# Altium schematic sheet Accelerometer.SchDoc
size A
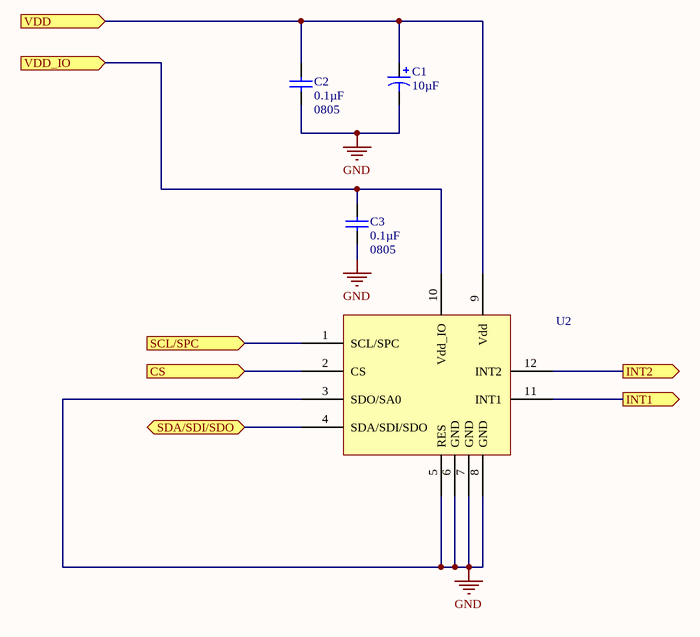
[diagram p0: Accelerometer.SchDoc]

## Parts
C1  Capacitance: 10µF  [Aluminum Cap 875105240001]  (hidden comment: 875105240001)
C2  Capacitance: 0.1µF  Package / Case: 0805  [CAP0805]  (hidden comment: C0805C104K5RACTU)
C3  Capacitance: 0.1µF  Package / Case: 0805  [CAP0805]  (hidden comment: C0805C104K5RACTU)
U2  LIS2HH12TR  [LIS2HH12TR]  (value not drawn)

## Ports
CS (in), INT1 (out), INT2 (out), SCL/SPC (in), SDA/SDI/SDO (bidir), VDD (in), VDD_IO (in)

## Nets
GND: C1.2 C2.1 C3.1 U2.3(SDO/SA0) U2.5(RES) U2.6(GND) U2.7(GND) U2.8(GND)
CS: U2.2(CS) ; port CS
INT1: U2.11(INT1) ; port INT1
INT2: U2.12(INT2) ; port INT2
SCL/SPC: U2.1(SCL/SPC) ; port SCL/SPC
SDA/SDI/SDO: U2.4(SDA/SDI/SDO) ; port SDA/SDI/SDO
VDD: C1.1 C2.2 U2.9(Vdd) ; port VDD
VDD_IO: C3.2 U2.10(Vdd_IO) ; port VDD_IO

## Library data of the parts
C1 = 875105240001: CAP ALUM POLY 10UF 20% 10V SMD; Type: Polymer; ESR (Equivalent Series Resistance): 45 mOhm; Lifetime @ Temp.: 2000 Hrs @ 105°C; Ripple Current - Low Frequency: 60mA @ 120Hz; Ripple Current - High Frequency: 1.2A @ 100kHz; Surface Mount Land Size: 0.169" L x 0.169" W (4.30mm x 4.30mm); Tolerance: ±20%; Voltage - Rated: 10V; Operating Temperature: -55°C ~ 105°C; Applications: General Purpose; Size / Dimension: 0.157" Dia (4.00mm); Height - Seated (Max): 0.217" (5.50mm); Package / Case: Radial, Can - SMD; Supplier 1: Digi-Key; Supplier Part Number 1: 732-6401-1-ND
C2 C3 = C0805C104K5RACTU: CAP CER 0.1UF 50V X7R 0805; Tolerance: ±10%; Supplier 1: Digi-Key; Supplier Part Number 1: 399-1170-1-ND; Voltage - Rated: 50V; Temperature Coefficient: X7R
U2 = LIS2HH12TR: ACCELEROMETER 2-8G I2C/SPI 12LGA; Axis: X, Y, Z; Acceleration Range: ±2g, 4g, 8g; Sensitivity (LSB/g): 16393 (±2g) ~ 4098 (±8g); Bandwidth: 5Hz ~ 400Hz; Output Type: I²C, SPI; 1.71 V ~ 3.6 V: Voltage - Supply; Type: Digital; Features: Adjustable Bandwidth, Selectable Scale, Temperature Sensor; Operating Temperature: -40°C ~ 85°C (TA); Package / Case: 12-VFLGA; Supplier 1: Digi-Key; Supplier Part Number 1: 497-15069-1-ND